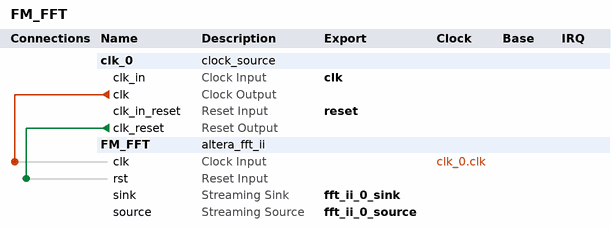
[diagram p0: system contents]
# Platform Designer (Qsys) system FM_FFT, Cyclone V 5CGXFC5C6F27C7
# Parameters at their usual value, and those the tool derives, are not listed.
package require -exact qsys 17.0
create_system FM_FFT
set_project_property DEVICE_FAMILY {Cyclone V}
set_project_property DEVICE 5CGXFC5C6F27C7

add_instance clk_0 clock_source 17.0
set_instance_parameter_value clk_0 clockFrequency 50000000

add_instance FM_FFT altera_fft_ii 17.0
set_instance_parameter_value FM_FFT data_flow {Variable Streaming}
set_instance_parameter_value FM_FFT data_rep {Fixed Point}
set_instance_parameter_value FM_FFT engine_arch {Quad Output}
set_instance_parameter_value FM_FFT in_width 14
set_instance_parameter_value FM_FFT length 8192
set_instance_parameter_value FM_FFT out_order {Digit Reverse}
set_instance_parameter_value FM_FFT out_width 26
set_instance_parameter_value FM_FFT twid_width 18

# connections
add_connection clk_0.clk FM_FFT.clk clock
add_connection clk_0.clk_reset FM_FFT.rst reset

# exported interfaces
add_interface clk clock sink
set_interface_property clk EXPORT_OF clk_0.clk_in
add_interface fft_ii_0_sink avalon_streaming sink
set_interface_property fft_ii_0_sink EXPORT_OF FM_FFT.sink
add_interface fft_ii_0_source avalon_streaming source
set_interface_property fft_ii_0_source EXPORT_OF FM_FFT.source
add_interface reset reset sink
set_interface_property reset EXPORT_OF clk_0.clk_in_reset

set_interconnect_requirement {$system} qsys_mm.clockCrossingAdapter HANDSHAKE
set_interconnect_requirement {$system} qsys_mm.enableEccProtection FALSE
set_interconnect_requirement {$system} qsys_mm.insertDefaultSlave FALSE
set_interconnect_requirement {$system} qsys_mm.maxAdditionalLatency 1

save_system FM_FFT.qsys
